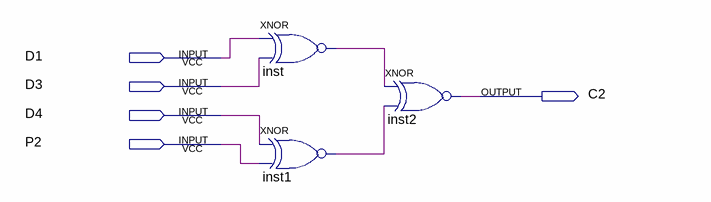
[diagram p0: schematic sheet]
// Quartus schematic check_c2.bdf as structural Verilog: 3 symbols, 5 pins
module check_c2 (
  input  D1,
  input  D3,
  input  D4,
  input  P2,
  output C2
);

  wire inst1_out, inst_out;

  xnor inst (inst_out, D1, D3);
  xnor inst1 (inst1_out, D4, P2);
  xnor inst2 (C2, inst_out, inst1_out);
endmodule
